# Altium schematic sheet cpuPower.SchDoc
size A
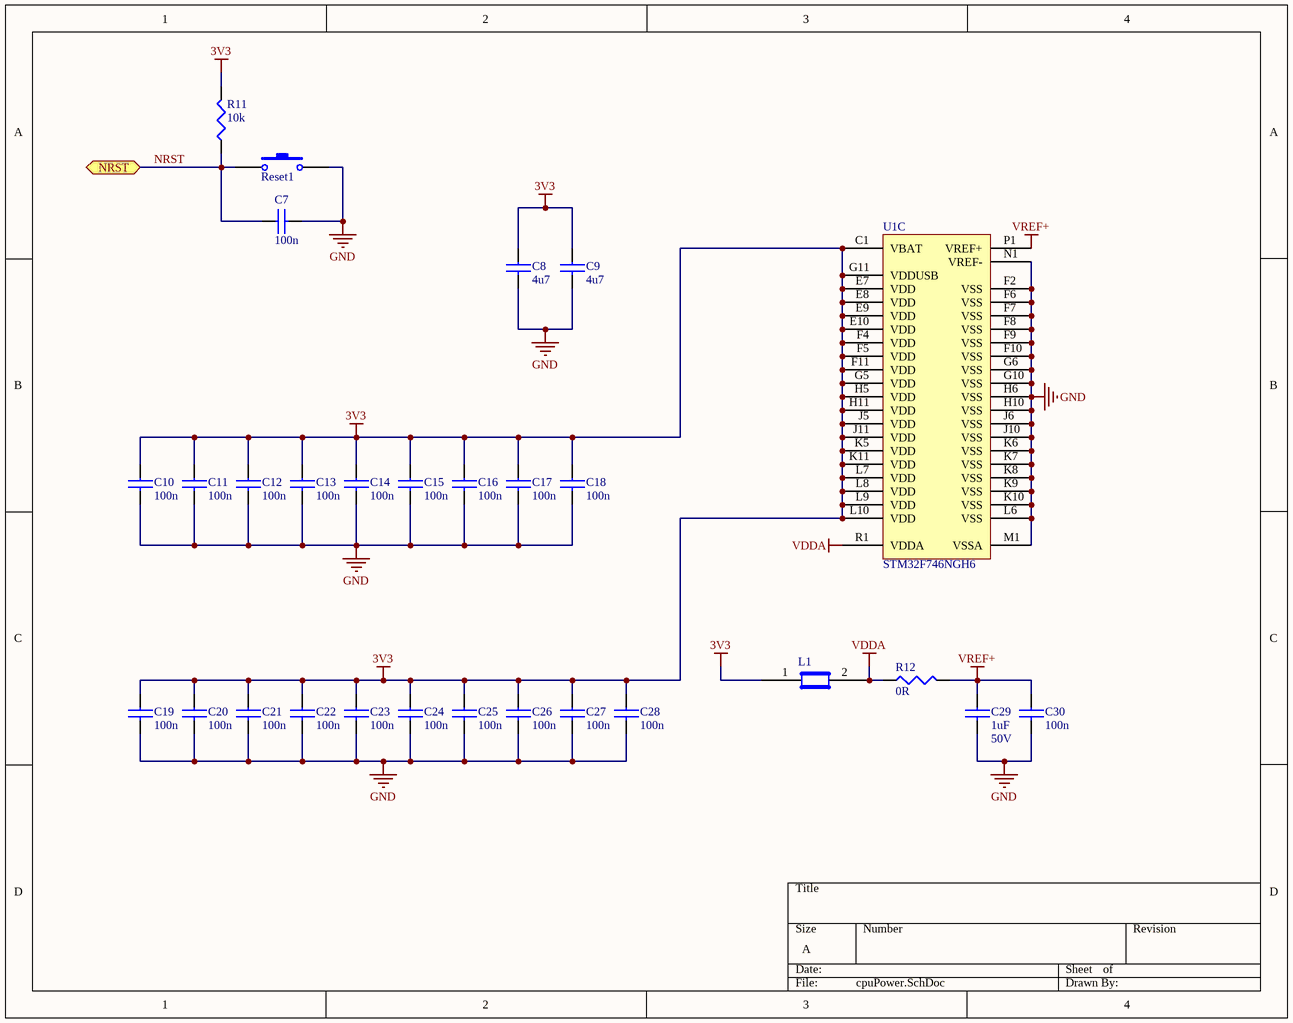
[diagram p0: cpuPower.SchDoc]

## Parts
C7  100n  [C0402]
C8  4u7  [C0402]
C9  4u7  [C0402]
C10  100n  [C0402]
C11  100n  [C0402]
C12  100n  [C0402]
C13  100n  [C0402]
C14  100n  [C0402]
C15  100n  [C0402]
C16  100n  [C0402]
C17  100n  [C0402]
C18  100n  [C0402]
C19  100n  [C0402]
C20  100n  [C0402]
C21  100n  [C0402]
C22  100n  [C0402]
C23  100n  [C0402]
C24  100n  [C0402]
C25  100n  [C0402]
C26  100n  [C0402]
C27  100n  [C0402]
C28  100n  [C0402]
C29  1uF  Voltage - Rated: 50V  [C0805]
C30  100n  [C0402]
L1  MPZ1608S601A 600OHM/1A  [C0603]  (value not drawn)
R11  10k  [R0402]
R12  0R  [R0402]
Reset1  Switch push  [Button Push smd]  (value not drawn)
U1  STM32F746NGH6  [STM-TFBGA216]  (part C of 3)

## Ports
NRST (bidir)

## Nets
3V3: C8.1 C9.1 C10.1 C11.1 C12.1 C13.1 C14.1 C15.1 C16.1 C17.1 C18.1 C19.1 C20.1 C21.1 C22.1 C23.1 C24.1 C25.1 C26.1 C27.1 C28.1 L1.1 R11.2 U1.C1(VBAT) U1.E7(VDD) U1.E8(VDD) U1.E9(VDD) U1.E10(VDD) U1.F4(VDD) U1.F5(VDD) U1.F11(VDD) U1.G5(VDD) U1.G11(VDDUSB) U1.H5(VDD) U1.H11(VDD) U1.J5(VDD) U1.J11(VDD) U1.K5(VDD) U1.K11(VDD) U1.L7(VDD) U1.L8(VDD) U1.L9(VDD) U1.L10(VDD)
GND: C7.2 C8.2 C9.2 C10.2 C11.2 C12.2 C13.2 C14.2 C15.2 C16.2 C17.2 C18.2 C19.2 C20.2 C21.2 C22.2 C23.2 C24.2 C25.2 C26.2 C27.2 C28.2 C29.2 C30.2 Reset1.2 U1.F2(VSS) U1.F6(VSS) U1.F7(VSS) U1.F8(VSS) U1.F9(VSS) U1.F10(VSS) U1.G6(VSS) U1.G10(VSS) U1.H6(VSS) U1.H10(VSS) U1.J6(VSS) U1.J10(VSS) U1.K6(VSS) U1.K7(VSS) U1.K8(VSS) U1.K9(VSS) U1.K10(VSS) U1.L6(VSS) U1.M1(VSSA) U1.N1(VREF-)
VDDA: L1.2 R12.1 U1.R1(VDDA)
VREF+: C29.1 C30.1 R12.2 U1.P1(VREF+)
NRST: C7.1 R11.1 Reset1.1 ; port NRST

## Library data of the parts
C7 C10-C28 C30 = C1005X5R1H104K: CAP CER .10UF 50V X5R 10% 0402; Manufacturer: TDK Corporation; Capacitance: 0.1µF; Value: 100nF; .Checked PCB: used; Category: Capacitors; Supplier Part Number: 445-5942-1-ND; Manufacturer Part Number: C1005X5R1H104K; Operating Temperature: -55°C ~ 85°C; Package / Case: 0402 (1005 Metric); Price 1k [$]: 0.02340; .Checked SCH: used; Voltage - Rated: 50V; Supplier: Digikey; Supplier 1: Digi-Key; Supplier Part Number 1: 445-5942-1-ND; RoHS: RoHS Compliant; Stock 1: 106926; Pricing 1: 1=0.27, 10=0.18, 100=0.072, 250=0.05176, 500=0.0369, 1000=0.027 (USD); Tolerance: ±10%; Temperature Coefficient: X5R; Mounting Type: Surface Mount, MLCC; Applications: General Purpose; Ratings: -; Size / Dimension: 0.039" L x 0.020" W (1.00mm x 0.50mm); Height - Seated (Max): -; Thickness (Max): 0.022" (0.55mm); Lead Spacing: -; Features: -; Packaging: Cut Tape (CT); Lead Style: -; ComponentLink1URL: http://www.tdk.co.jp/tefe02/e412_c.pdf; ComponentLink1Description: http://www.tdk.co.jp/tefe02/e412_c.pdf
C8 C9 = C1005X5R1A475M: CAP CER 4.7UF 10V 20% X5R 0402; Manufacturer: TDK Corporation; Capacitance: 4.7µF; .Checked PCB: RF; Supplier 1: Digi-Key; Supplier Part Number 1: 445-8023-1-ND; Manufacturer Part Number: C1005X5R1A475M; RoHS: RoHS Compliant; Category: Capacitors; Stock 1: 10140; Pricing 1: 1=0.53, 10=0.415, 100=0.25, 250=0.18752, 500=0.16, 1000=0.125, 5000=0.095 (USD); Voltage - Rated: 10V; Tolerance: ±20%; Temperature Coefficient: X5R; Mounting Type: Surface Mount, MLCC; Operating Temperature: -55°C ~ 85°C; Applications: General Purpose; Ratings: -; Package / Case: 0402 (1005 Metric); Size / Dimension: 0.039" L x 0.020" W (1.00mm x 0.50mm); Height - Seated (Max): -; Thickness (Max): -; Lead Spacing: -; Features: -; Packaging: Cut Tape (CT); Lead Style: -; ComponentLink1URL: http://www.tdk.com/pdf/general_B11.pdf; ComponentLink1Description: http://www.tdk.com/pdf/general_B11.pdf; .Checked SCH: RF
C29 = GRM21BR71H105KA12L: CAP CER 1UF 50V X7R 0805; Manufacturer: Murata Electronics North America; Capacitance: 1.0µF; .Checked PCB: used; Tolerance: ±10%; Category: Capacitors; Manufacturer Part Number: GRM21BR71H105KA12L; Operating Temperature: -55°C ~ 125°C; Package / Case: 0805 (2012 Metric); Price 1k [$]: 0.1359; Value: 1uF; .Checked SCH: used; Supplier Part Number: 490-4736-1-ND; Supplier: Digikey; Supplier 1: Digi-Key; Supplier Part Number 1: 490-4736-1-ND; RoHS: RoHS Compliant; Stock 1: 422791; Pricing 1: 1=0.28, 10=0.254, 25=0.226, 50=0.1978, 100=0.1836, 250=0.16952, 500=0.16102, 750=0.14691, 1000=0.12995 (USD); Temperature Coefficient: X7R; Mounting Type: Surface Mount, MLCC; Applications: General Purpose; Ratings: -; Size / Dimension: 0.079" L x 0.049" W (2.00mm x 1.25mm); Height - Seated (Max): -; Thickness (Max): 0.053" (1.35mm); Lead Spacing: -; Features: -; Packaging: Cut Tape (CT); Lead Style: -; ComponentLink1URL: http://search.murata.co.jp/Ceramy/image/img/PDF/ENG/GRM21BR71H105KA12.pdf; ComponentLink1Description: http://search.murata.co.jp/Ceramy/image/img/PDF/ENG/GRM21BR71H105KA12.pdf
L1 = MPZ1608S601A: FERRITE CHIP BEAD 600 OHM SMD 1A; Manufacturer: TDK Corporation; Impedance @ Frequency: 600 Ohm @ 100MHz; DC Resistance (DCR): 150 mOhm Max; Filter Type: Differential Mode - Single; Number of Lines: 1; .Checked PCB: RF; Supplier 1: Digi-Key; Supplier Part Number 1: 445-2205-1-ND; Manufacturer Part Number: MPZ1608S601A; RoHS: RoHS Compliant; Category: Filters; Stock 1: 328345; Pricing 1: 1=0.36, 10=0.24, 100=0.096, 250=0.069, 500=0.0492, 1000=0.036 (USD); Current Rating: 1A; Package / Case: 0603 (1608 Metric); Mounting Type: Surface Mount; Packaging: Cut Tape (CT); Height (Max): 0.037" (0.95mm); Size / Dimension: 0.063" L x 0.031" W (1.60mm x 0.80mm); ComponentLink1URL: http://www.tdk.co.jp/tefe02/e9413_mpz.pdf; ComponentLink1Description: http://www.tdk.co.jp/tefe02/e9413_mpz.pdf; .Checked SCH: RF
R11 = RC0402FR-0710KL: RES 10.0K OHM 1/16W 1% 0402 SMD; Manufacturer: Yageo; Power (Watts): 0.063W, 1/16W; .Checked PCB: used; Temperature Coefficient: ±100ppm/°C; Category: Resistors; Supplier Part Number: 311-10.0KLRCT-ND; Manufacturer Part Number: RC0402FR-0710KL; Package / Case: 0402 (1005 Metric); Price 1k [$]: 0.01421; Resistance (Ohms): 10K; Tolerance: ±1%; Value: 10k; .Checked SCH: used; Supplier: Digikey; Supplier 1: Digi-Key; Supplier Part Number 1: 311-10.0KLRCT-ND; RoHS: RoHS Compliant; Stock 1: 2916495; Pricing 1: 10=0.014, 50=0.0104, 100=0.0079, 250=0.00584, 500=0.00432, 1000=0.00288 (USD); Composition: Thick Film; Features: -; Size / Dimension: 0.039" L x 0.020" W (1.00mm x 0.50mm); Height: 0.016" (0.40mm); Number of Terminations: 2; Packaging: Cut Tape (CT); ComponentLink1URL: http://www.yageo.com/documents/recent/PYu-RC0402_51_RoHS_L_6.pdf; ComponentLink1Description: http://www.yageo.com/documents/recent/PYu-RC0402_51_RoHS_L_6.pdf
R12 = RC0402JR-070RL: RES 0.0 OHM 1/16W 0402 SMD; Manufacturer: Yageo; Resistance (Ohms): 0.0; Power (Watts): 0.063W, 1/16W; Tolerance: Jumper; .Checked PCB: used; Category: Resistors; Supplier Part Number: 311-0.0JRCT-ND; Manufacturer Part Number: RC0402JR-070RL; Package / Case: 0402 (1005 Metric); Price 1k [$]: 0.01389; Value: 0R; .Checked SCH: used; Supplier: Digikey; Supplier 1: Digi-Key; Supplier Part Number 1: 311-0.0JRCT-ND; RoHS: RoHS Compliant; Stock 1: 1106330; Pricing 1: 10=0.012, 50=0.009, 100=0.0069, 250=0.00512, 500=0.0038, 1000=0.00253 (USD); Composition: Thick Film; Features: -; Temperature Coefficient: -; Size / Dimension: 0.039" L x 0.020" W (1.00mm x 0.50mm); Height: 0.016" (0.40mm); Number of Terminations: 2; Packaging: Cut Tape (CT); ComponentLink1URL: http://www.yageo.com/documents/recent/PYu-RC0402_51_RoHS_L_6.pdf; ComponentLink1Description: http://www.yageo.com/documents/recent/PYu-RC0402_51_RoHS_L_6.pdf
Reset1 = switch: single swithc; DISIGNER: ARMAN ARVAND
U1 = STM32F746NGH6: ARM-Based Cortex-M7 32 Bit MCU+FPU, 462 DMIPS, 1024 kB Flash, 320 kB RAM, 168 I/Os, -40 to 85 degC, 216-Pin TFBGA, Halogen-Free, Tray; L1 Cache Data Memory: 4 KByte; Program Memory Size: 1024 KByte; Supply Voltage Max: 3.6 V; Clock Frequency Max: 216 MHz; Supply Voltage Min: 1.7 V; Number of I/Os: 168; Data RAM Size: 320 KByte; Data Bus Width: 32 bit; Temperature Min: -40 degC; L1 Cache Instruction Memory: 4 KByte; PartNumber: STM32F746NG; ComponentLink1Description: Manufacturer URL; ComponentLink2Description: Datasheet; DatasheetVersion: Rev. 1; ComponentLink3URL: http://www.st.com/st-web-ui/static/active/en/resource/technical/document/data_brief/DM00053488.pdf; ComponentLink1URL: http://www.st.com/web/en/home.html; Packing: Tray; ComponentLink2URL: http://www.st.com/st-web-ui/static/active/en/resource/technical/document/datasheet/DM00166116.pdf; ComponentLink3Description: Package Specification; PackageVersion: Rev. 2, 05/2013; Mounting Technology: Surface Mount; PackageDescription: 216-Ball Ultra Thin Fine Pitch Ball Grid Array, 13 x 13 x 0.8 mm Body, 0.8 mm Pitch; Temperature Max: 85 degC